# EAGLE design FDC9266_floppy_korr (EAGLE 9.6.2)
Assembly variants: rcbus
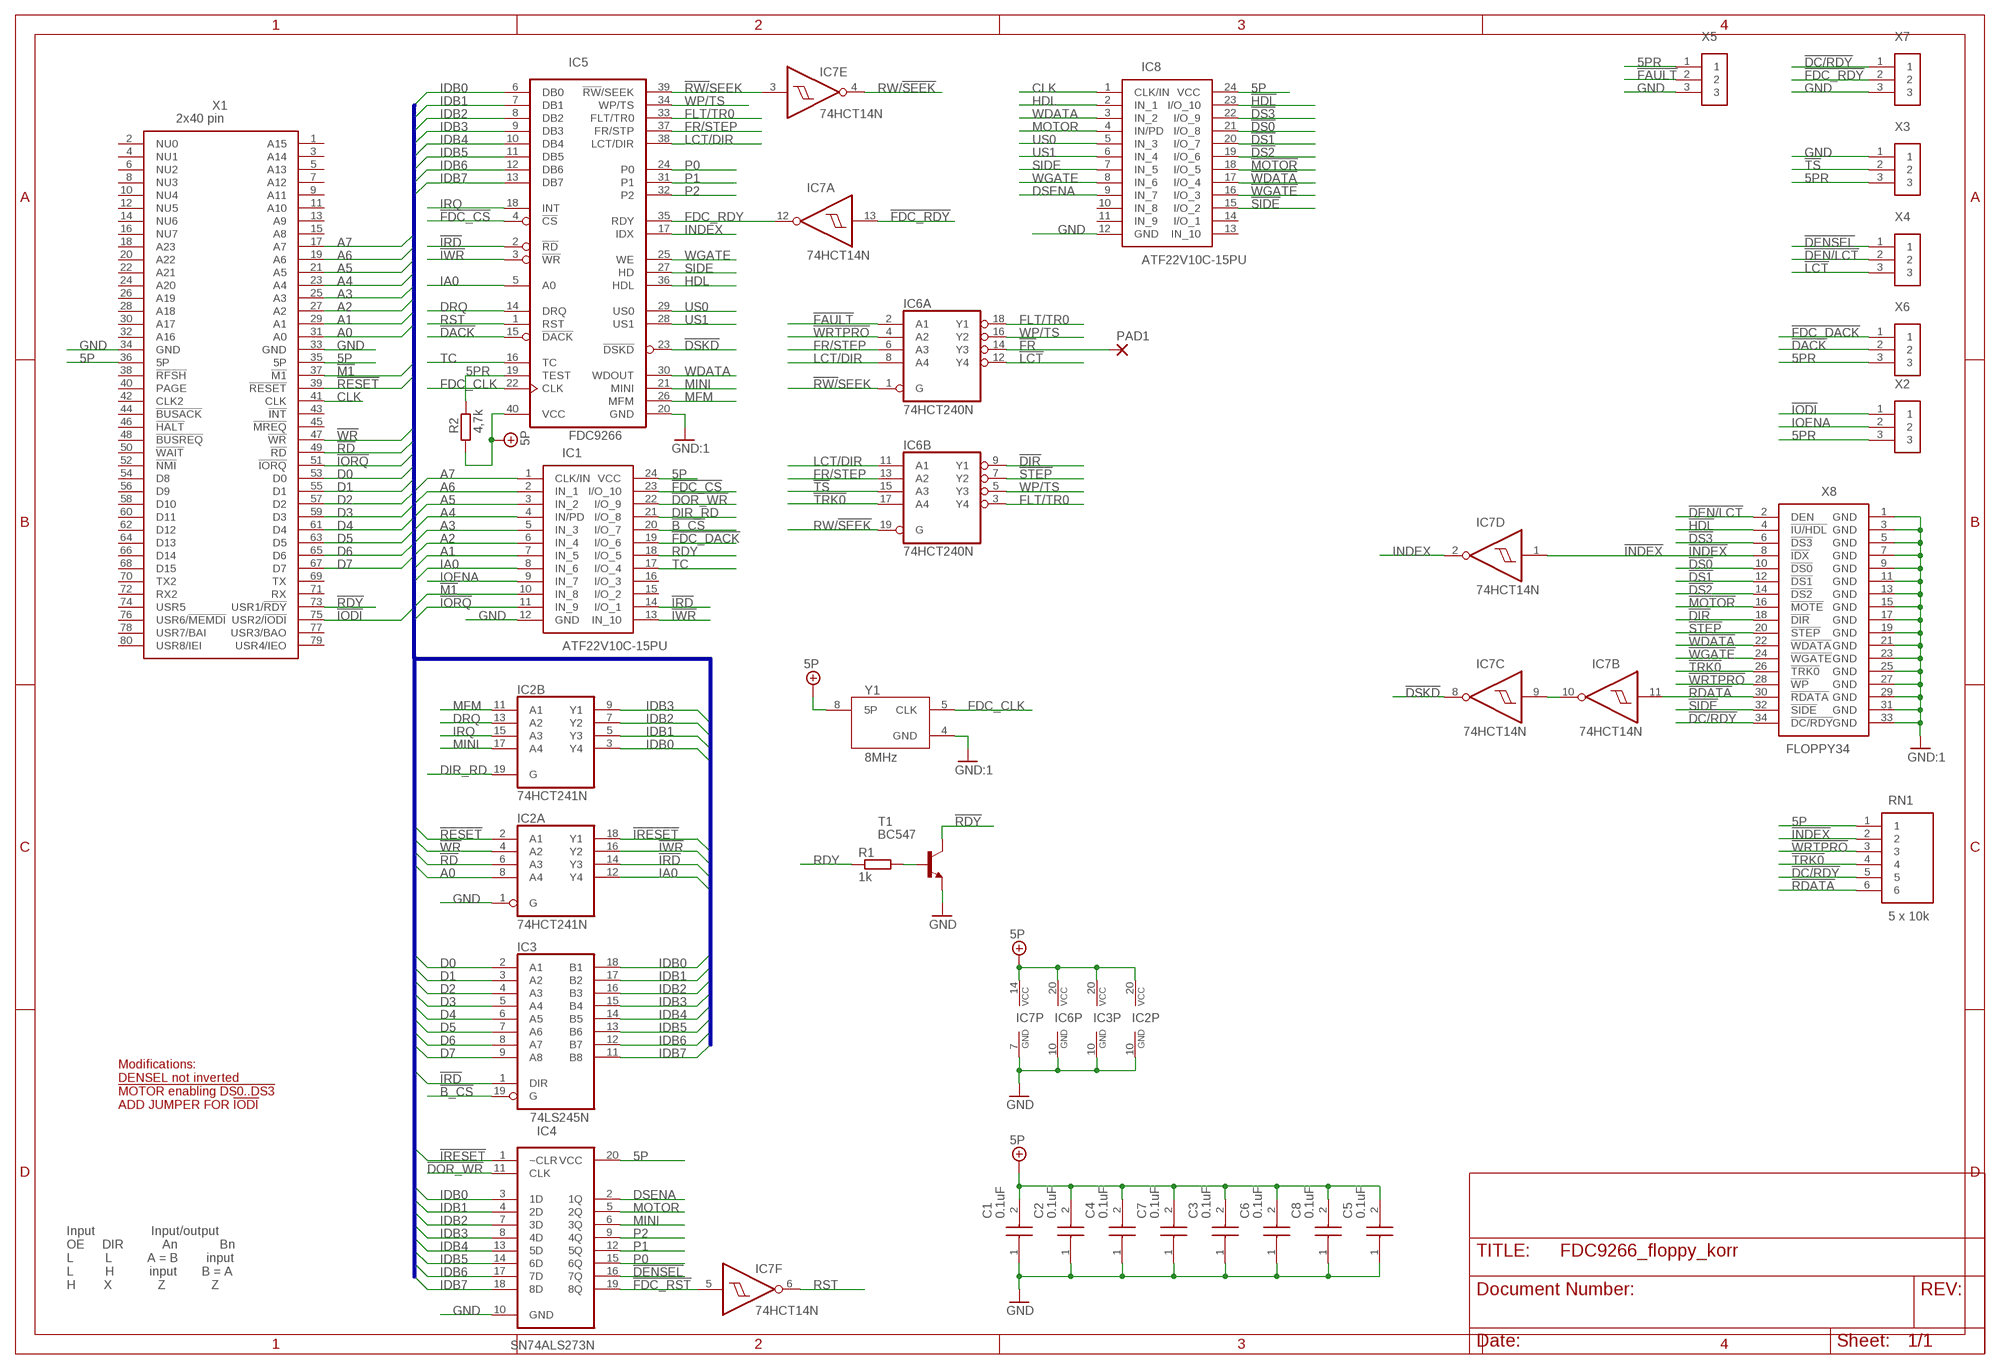
[diagram p0: schematic, sheet 1]

## Parts
C1  0.1uF  C315C103K5R5TA7303  [C315C103K5R5TA7303]
C2  0.1uF  C315C103K5R5TA7303  [C315C103K5R5TA7303]
C3  0.1uF  C315C103K5R5TA7303  [C315C103K5R5TA7303]
C4  0.1uF  C315C103K5R5TA7303  [C315C103K5R5TA7303]
C5  0.1uF  C315C103K5R5TA7303  [C315C103K5R5TA7303]
C6  0.1uF  C315C103K5R5TA7303  [C315C103K5R5TA7303]
C7  0.1uF  C315C103K5R5TA7303  [C315C103K5R5TA7303]
C8  0.1uF  C315C103K5R5TA7303  [C315C103K5R5TA7303]
IC1  ATF22V10C-15PU  [DIP794W56P254L3188H533Q24N]
IC2  74HCT241N  [DIL20]
IC3  74LS245N  [DIL20]
IC4  SN74ALS273N  [DIP254P762X508-20]
IC5  FDC9266  [DIP1550W53P254L5232H424Q40N]
IC6  74HCT240N  [DIL20]
IC7  74HCT14N  [DIL14]
IC8  ATF22V10C-15PU  [DIP794W56P254L3188H533Q24N]
PAD1  WIREPAD1,6/0,8  [1,6/0,8]
R1  1k  R_EU_020710  [0207/10]  (not fitted in variant rcbus)
R2  4,7k  R_EU_020710  [0207/10]
RN1  5 x 10k  4606X-101-103LF  [4606X102103LF]
T1  BC547  [TO92]  (not fitted in variant rcbus)
X1  2x40 pin  RCBUS_80_RA  [RC2014_80_RA]
X2  TSW-103-07-G-S07  [TSW-103-XX-G-S]
X3  TSW-103-07-G-S07  [TSW-103-XX-G-S]
X4  TSW-103-07-G-S07  [TSW-103-XX-G-S]
X5  TSW-103-07-G-S07  [TSW-103-XX-G-S]
X6  TSW-103-07-G-S07  [TSW-103-XX-G-S]
X7  TSW-103-07-G-S07  [TSW-103-XX-G-S]
X8  FLOPPY34  [09185346323]
Y1  8MHz  ECS-2100AX-200  [ECS-2100AX-200]

## Nets
5P: C1.2 C2.2 C3.2 C4.2 C5.2 C6.2 C7.2 C8.2 IC1.24(VCC) IC2.20(P:VCC) IC3.20(VCC) IC4.20(VCC) IC5.40(VCC) IC6.20(P:VCC) IC7.14(P:VCC) IC8.24(VCC) R2.1 RN1.1 X1.35(5P) X1.36(5P) Y1.8(5P)
5PR: IC5.19(TEST) R2.2 X2.3 X3.3 X5.1 X6.3
!B_CS: IC1.20(I/O_7) IC3.19(G)
!DACK: IC5.15(!DACK) X6.2
!DC/RDY: RN1.5 X7.1 X8.34(!DC/RDY)
!DEN/LCT: X4.2 X8.2(DEN)
!DENSEL: IC4.16(7Q) X4.1
!DIR: IC6.9(B:Y1) X8.18(!DIR)
!DOR_WR: IC1.22(I/O_9) IC4.11(CLK)
!DS0: IC8.21(I/O_8) X8.10(!DS0)
!DS1: IC8.20(I/O_7) X8.12(!DS1)
!DS2: IC8.19(I/O_6) X8.14(!DS2)
!DS3: IC8.22(I/O_9) X8.6(!DS3)
!DSKD: IC5.23(!DSKD) IC7.8(C:O)
!FAULT: IC6.2(A:A1) X5.2
!FDC_CS: IC1.23(I/O_10) IC5.4(!CS)
!FDC_DACK: IC1.19(I/O_6) X6.1
!FDC_RDY: IC7.13(A:I) X7.2
!FDC_RST: IC4.19(8Q) IC7.5(F:I)
!FR: IC6.14(A:Y3) PAD1.1(P)
!HDL: IC8.23(I/O_10) X8.4(!IU/HDL)
!INDEX: IC7.1(D:I) RN1.2 X8.8(!IDX)
!IODI: X1.75(USR2/!IODI) X2.1
!IORQ: IC1.11(IN_9) X1.51(!IORQ)
!IRD: IC1.14(I/O_1) IC2.14(A:Y3) IC3.1(DIR) IC5.2(!RD)
!IRESET: IC2.18(A:Y1) IC4.1(~CLR)
!IWR: IC1.13(IN_10) IC2.16(A:Y2) IC5.3(!WR)
!LCT: IC6.12(A:Y4) X4.3
!M1: IC1.10(IN_8) X1.37(!M1)
!MOTOR: IC8.18(I/O_5) X8.16(!MOTE)
!RD: IC2.6(A:A3) X1.49(!RD)
!RDATA: IC7.11(B:I) RN1.6 X8.30(!RDATA)
!RDY: T1.3(C) X1.73(USR1/!RDY)
!RESET: IC2.2(A:A1) X1.39(!RESET)
!RW/!SEEK: IC5.39(!RW!/SEEK) IC6.1(A:G) IC7.3(E:I)
!SIDE: IC8.15(I/O_2) X8.32(!SIDE)
!STEP: IC6.7(B:Y2) X8.20(!STEP)
!TRK0: IC6.17(B:A4) RN1.4 X8.26(!TRK0)
!TS: IC6.15(B:A3) X3.2
!WDATA: IC8.17(I/O_4) X8.22(!WDATA)
!WGATE: IC8.16(I/O_3) X8.24(!WGATE)
!WR: IC2.4(A:A2) X1.47(!WR)
!WRTPRO: IC6.4(A:A2) RN1.3 X8.28(!WP)
A0: IC2.8(A:A4) X1.31(A0)
A1: IC1.7(IN_5) X1.29(A1)
A2: IC1.6(IN_4) X1.27(A2)
A3: IC1.5(IN_3) X1.25(A3)
A4: IC1.4(IN/PD) X1.23(A4)
A5: IC1.3(IN_2) X1.21(A5)
A6: IC1.2(IN_1) X1.19(A6)
A7: IC1.1(CLK/IN) X1.17(A7)
CLK: IC8.1(CLK/IN) X1.41(CLK)
D0: IC3.2(A1) X1.53(D0)
D1: IC3.3(A2) X1.55(D1)
D2: IC3.4(A3) X1.57(D2)
D3: IC3.5(A4) X1.59(D3)
D4: IC3.6(A5) X1.61(D4)
D5: IC3.7(A6) X1.63(D5)
D6: IC3.8(A7) X1.65(D6)
D7: IC3.9(A8) X1.67(D7)
DIR_RD: IC1.21(I/O_8) IC2.19(B:G)
DRQ: IC2.13(B:A2) IC5.14(DRQ)
DSENA: IC4.2(1Q) IC8.9(IN_7)
FDC_CLK: IC5.22(CLK) Y1.5(CLK)
FDC_RDY: IC5.35(RDY) IC7.12(A:O)
FLT/TR0: IC5.33(FLT/TR0) IC6.3(B:Y4) IC6.18(A:Y1)
FR/STEP: IC5.37(FR/STP) IC6.6(A:A3) IC6.13(B:A2)
GND: C1.1 C2.1 C3.1 C4.1 C5.1 C6.1 C7.1 C8.1 IC1.12(GND) IC2.1(A:G) IC2.10(P:GND) IC3.10(GND) IC4.10(GND) IC5.20(GND) IC6.10(P:GND) IC7.7(P:GND) IC8.12(GND) T1.1(E) X1.33(GND) X1.34(GND) X3.1 X5.3 X7.3 X8.1(GND) X8.3(GND) X8.5(GND) X8.7(GND) X8.9(GND) X8.11(GND) X8.13(GND) X8.15(GND) X8.17(GND) X8.19(GND) X8.21(GND) X8.23(GND) X8.25(GND) X8.27(GND) X8.29(GND) X8.31(GND) X8.33(GND) Y1.4(GND) ; supply symbol labelled GND:1
HDL: IC5.36(HDL) IC8.2(IN_1)
IA0: IC1.8(IN_6) IC2.12(A:Y4) IC5.5(A0)
IDB0: IC2.3(B:Y4) IC3.18(B1) IC4.3(1D) IC5.6(DB0)
IDB1: IC2.5(B:Y3) IC3.17(B2) IC4.4(2D) IC5.7(DB1)
IDB2: IC2.7(B:Y2) IC3.16(B3) IC4.7(3D) IC5.8(DB2)
IDB3: IC2.9(B:Y1) IC3.15(B4) IC4.8(4D) IC5.9(DB3)
IDB4: IC3.14(B5) IC4.13(5D) IC5.10(DB4)
IDB5: IC3.13(B6) IC4.14(6D) IC5.11(DB5)
IDB6: IC3.12(B7) IC4.17(7D) IC5.12(DB6)
IDB7: IC3.11(B8) IC4.18(8D) IC5.13(DB7)
INDEX: IC5.17(IDX) IC7.2(D:O)
IOENA: IC1.9(IN_7) X2.2
IRQ: IC2.15(B:A3) IC5.18(INT)
LCT/DIR: IC5.38(LCT/DIR) IC6.8(A:A4) IC6.11(B:A1)
MFM: IC2.11(B:A1) IC5.26(MFM)
MINI: IC2.17(B:A4) IC4.6(3Q) IC5.21(MINI)
MOTOR: IC4.5(2Q) IC8.4(IN/PD)
N$1: IC7.9(C:I) IC7.10(B:O)
N$3: R1.2 T1.2(B)
P0: IC4.15(6Q) IC5.24(P0)
P1: IC4.12(5Q) IC5.31(P1)
P2: IC4.9(4Q) IC5.32(P2)
RDY: IC1.18(I/O_5) R1.1
RST: IC5.1(RST) IC7.6(F:O)
RW/!SEEK: IC6.19(B:G) IC7.4(E:O)
SIDE: IC5.27(HD) IC8.7(IN_5)
TC: IC1.17(I/O_4) IC5.16(TC)
US0: IC5.29(US0) IC8.5(IN_3)
US1: IC5.28(US1) IC8.6(IN_4)
WDATA: IC5.30(WDOUT) IC8.3(IN_2)
WGATE: IC5.25(WE) IC8.8(IN_6)
WP/TS: IC5.34(WP/TS) IC6.5(B:Y3) IC6.16(A:Y2)
Unconnected: IC1.15(I/O_2) IC1.16(I/O_3) IC8.10(IN_8) IC8.11(IN_9) IC8.13(IN_10) IC8.14(I/O_1) X1.1(A15) X1.2(NU0) X1.3(A14) X1.4(NU1) X1.5(A13) X1.6(NU2) X1.7(A12) X1.8(NU3) X1.9(A11) X1.10(NU4) X1.11(A10) X1.12(NU5) X1.13(A9) X1.14(NU6) X1.15(A8) X1.16(NU7) X1.18(A23) X1.20(A22) X1.22(A21) X1.24(A20) X1.26(A19) X1.28(A18) X1.30(A17) X1.32(A16) X1.38(!RFSH) X1.40(PAGE) X1.42(CLK2) X1.43(!INT) X1.44(!BUSACK) X1.45(!MREQ) X1.46(!HALT) X1.48(!BUSREQ) X1.50(!WAIT) X1.52(!NMI) X1.54(D8) X1.56(D9) X1.58(D10) X1.60(D11) X1.62(D12) X1.64(D13) X1.66(D14) X1.68(D15) X1.69(TX) X1.70(TX2) X1.71(RX) X1.72(RX2) X1.74(USR5) X1.76(USR6/!MEMDI) X1.77(USR3/BAO) X1.78(USR7/BAI) X1.79(USR4/IEO) X1.80(USR8/IEI)

## Buses
A[0..7],CLK,D[0..7],IA0,IDB[0..7],!IODI,!IORQ,!IRD,!IRESET,!IWR,!M1,!RD,!RESET,!WR

## Notes on the sheet
- Modifications:
  DENSEL not inverted
  !MOTOR enabling DS0..DS3
  ADD JUMPER FOR !IODI
- Input                Input/output
  OE     DIR           An            Bn
  L         L          A = B        input
  L         H          input       B = A
  H        X             Z             Z

## Library data of the parts
C1-C8 = FDC9266_floppy_korr:C315C103K5R5TA7303: GoldMax 300 Comm X7R, Ceramic, 0.01 uF, 10%, 50 VDC, 125 VDC, 125C, -55C, X7R, GoldMax, Commercial Standard, 2.5 % , 100 GOhms, 3.81mm, 3.14mm, 2.54mm, Lead Spacing = 2.54mm, 18mm, 0.51mm, 2500, 80 Source: Datasheet <https://content.kemet.com/datasheets/KEM_C1050_GOLDMAX_X7R.pdf>; ARROW_PART_NUMBER: C315C103K5R5TA7303; ARROW_PRICE-STOCK: https://www.arrow.com/en/products/c315c103k5r5ta7303/kemet-corporation?region=nac; DESCRIPTION: GoldMax 300 Comm X7R, Ceramic, 0.01 uF, 10%, 50 VDC, 125 VDC, 125C, -55C, X7R, GoldMax, Commercial Standard, 2.5 % , 100 GOhms, 3.81mm, 3.14mm, 2.54mm, Lead Spacing = 2.54mm, 18mm, 0.51mm, 2500, 80; HEIGHT: 4.66mm; MANUFACTURER_NAME: KEMET; MANUFACTURER_PART_NUMBER: C315C103K5R5TA7303; MOUSER_PART_NUMBER: 80-C315C103K5R-TR; MOUSER_PRICE-STOCK: https://www.mouser.co.uk/ProductDetail/KEMET/C315C103K5R5TA7303?qs=LJ1pyEEo5rYBfSJP9%252BZ%252BkA%3D%3D
IC1 IC8 = FDC9266_floppy_korr:ATF22V10C-15PU: Microchip ATF22V10C-15PU, SPLD Simple Programmable Logic Device Source: Datasheet <http://ww1.microchip.com/downloads/en/DeviceDoc/doc0735.pdf>; ARROW_PART_NUMBER: ATF22V10C-15PU; ARROW_PRICE-STOCK: https://www.arrow.com/en/products/atf22v10c-15pu/microchip-technology?region=nac; DESCRIPTION: Microchip ATF22V10C-15PU, SPLD Simple Programmable Logic Device; HEIGHT: 5.334mm; MANUFACTURER_NAME: Microchip; MANUFACTURER_PART_NUMBER: ATF22V10C-15PU; MOUSER_PART_NUMBER: 556-AF22V10C15PU; MOUSER_PRICE-STOCK: https://www.mouser.co.uk/ProductDetail/Microchip-Technology-Atmel/ATF22V10C-15PU?qs=2mdvTlUeTfCr46ZvfjTtAg%3D%3D
IC2 = FDC9266_floppy_korr:74*241: Octal BUFFER and LINE DRIVER, 3-state
IC3 = FDC9266_floppy_korr:74*245: Octal BUS TRANSCEIVER, 3-state
IC4 = FDC9266_floppy_korr:SN74ALS273N: OCTAL D-TYPE FLIP-FLOPS; MPN: SN74ALS273N; OC_FARNELL: 1607723; OC_NEWARK: 08F6025; PACKAGE: PDIP-20; SUPPLIER: Texas Instruments
IC5 = FDC9266_floppy_korr:FDC9266: FDC9266 MFM Disk Controller
IC6 = FDC9266_floppy_korr:74*240: Octal BUFFER and LINE DRIVER, 3-state
IC7 = FDC9266_floppy_korr:74*14: Hex schmitt trigger INVERTER
PAD1 = FDC9266_floppy_korr:WIREPAD: Wire PAD connect wire on PCB
R1 R2 = FDC9266_floppy_korr:R_EU_0207: RESISTOR, European symbol; SPICEPREFIX: R
RN1 = FDC9266_floppy_korr:4606X-101-103LF: 5-bussed thick film resistor,10K 0.2W Bourns Bussed Resistor Network 10k +/-2% 5 Resistors, 0.75W Total, SIP package 4600X Through Hole Source: Datasheet <https://www.bourns.com/pdfs/4600X.pdf>; ARROW_PART_NUMBER: 4606X-101-103LF; ARROW_PRICE-STOCK: https://www.arrow.com/en/products/4606x-101-103lf/bourns?region=europe; DESCRIPTION: 5-bussed thick film resistor,10K 0.2W Bourns Bussed Resistor Network 10k +/-2% 5 Resistors, 0.75W Total, SIP package 4600X Through Hole; HEIGHT: 5mm; MANUFACTURER_NAME: Bourns; MANUFACTURER_PART_NUMBER: 4606X-101-103LF; MOUSER_PART_NUMBER: 652-4606X-1LF-10K; MOUSER_PRICE-STOCK: https://www.mouser.co.uk/ProductDetail/Bourns/4606X-101-103LF?qs=Qv7qbSW4mEHqAfbN3SBBUw%3D%3D
T1 = FDC9266_floppy_korr:BC547: NPN TRANSISTOR
X1 = FDC9266_floppy_korr:RCBUS_80_RA: RC2014 extended bus 80 pin board connector
X2-X7 = FDC9266_floppy_korr:TSW-103-07-G-S: THROUGH-HOLE .025" SQ POST HEADER Source: Samtec TSW.pdf; MF: Samtec Inc.; MPN: TSW-103-07-G-S
X8 = FDC9266_floppy_korr:FLOPPY34: Connectors, Male connector, Wave soldering termination, Rated current: 1 A, Angled, Copper alloy, Sn over Ni, Termination side, Au over Pd/Ni, Mating side, Performance level: 2, Thermoplastic resin (PBT), Grey Source: Datasheet <https://b2b.harting.com/files/download/PRD/PDF_TS/09185XXX323_100154466DRW007A.pdf?showPrivacyEmailAgreement=false&contextURL=https://b2b.harting.com/ebusiness/en_us&siteName=Ebusiness Site&autoLogoutEnabled=true&autoLogoutTime=1805>; ARROW_PART_NUMBER: 09185346323; ARROW_PRICE-STOCK: https://www.arrow.com/en/products/09185346323/harting?region=nac; DESCRIPTION: Connectors, Male connector, Wave soldering termination, Rated current: 1 A, Angled, Copper alloy, Sn over Ni, Termination side, Au over Pd/Ni, Mating side, Performance level: 2, Thermoplastic resin (PBT), Grey; HEIGHT: 8.9mm; MANUFACTURER_NAME: HARTING; MANUFACTURER_PART_NUMBER: 09185346323; MOUSER_PART_NUMBER: 617-09-18-534-6323; MOUSER_PRICE-STOCK: https://www.mouser.co.uk/ProductDetail/HARTING/09185346323?qs=GZB%2FOSW0r0GMbz7Zhp6Wbw%3D%3D
Y1 = FDC9266_floppy_korr:ECS-2100AX-200: XTAL OSC XO 20.0000MHZ HCMOS TTL Manufacturer's datasheet <https://ecsxtal.com/store/pdf/ecs-2100x.pdf>; CREATED_BY: PCBLayout.com; DIGIKEY_PART_NUMBER: X964-ND; MANUFACTURER: ECS Inc.; MPN: ECS-2100AX-200; PACKAGE: 8-DIP

## Net classes
0 default: width 0.254 mm
1 pwr: width 1.016 mm

## Board
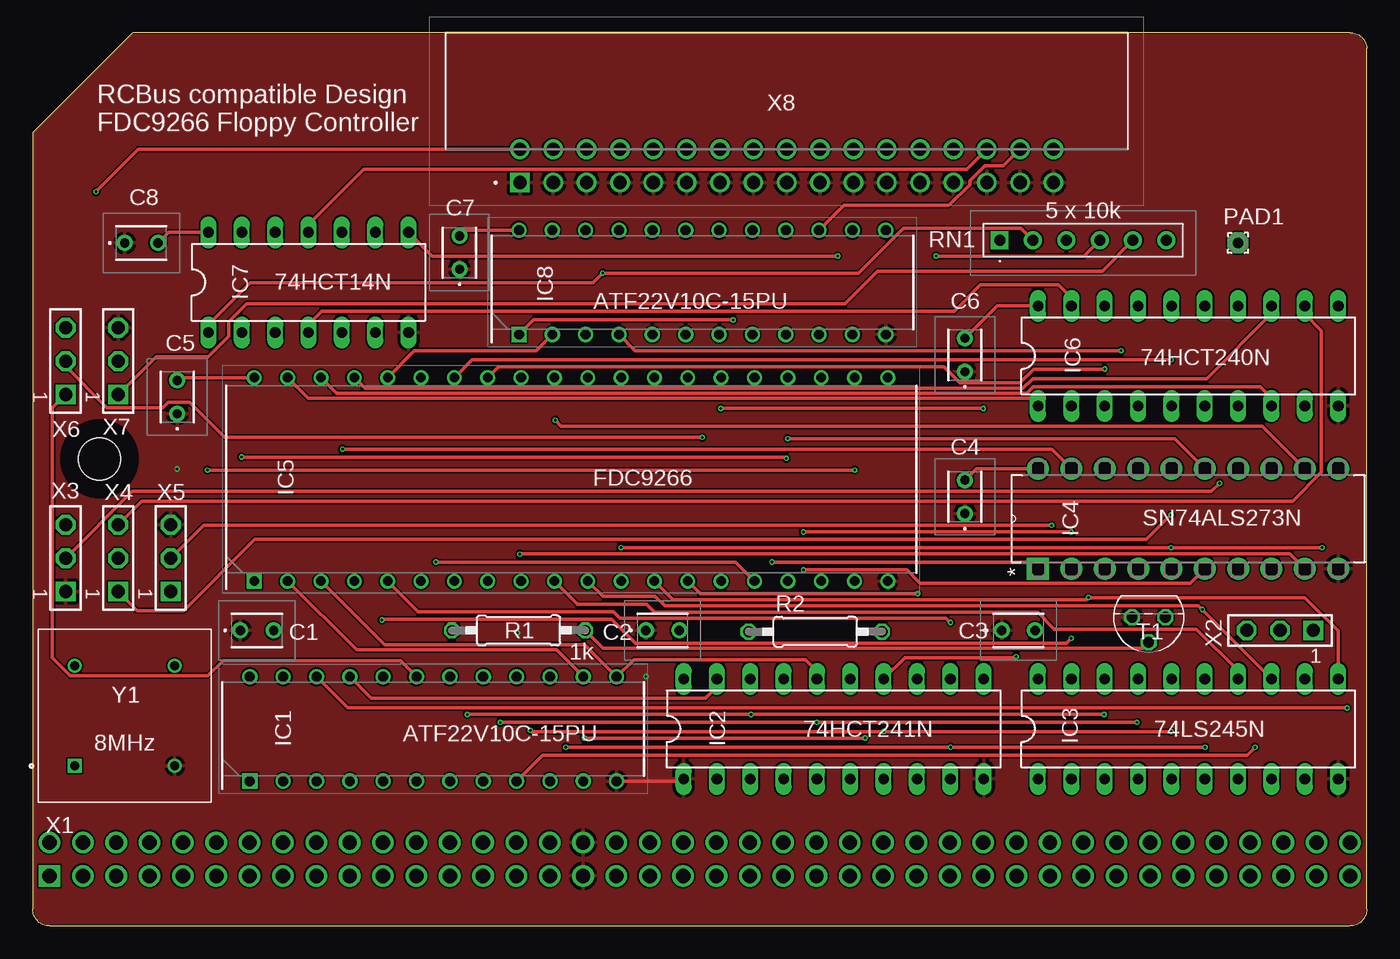
[diagram p1: board, top side]
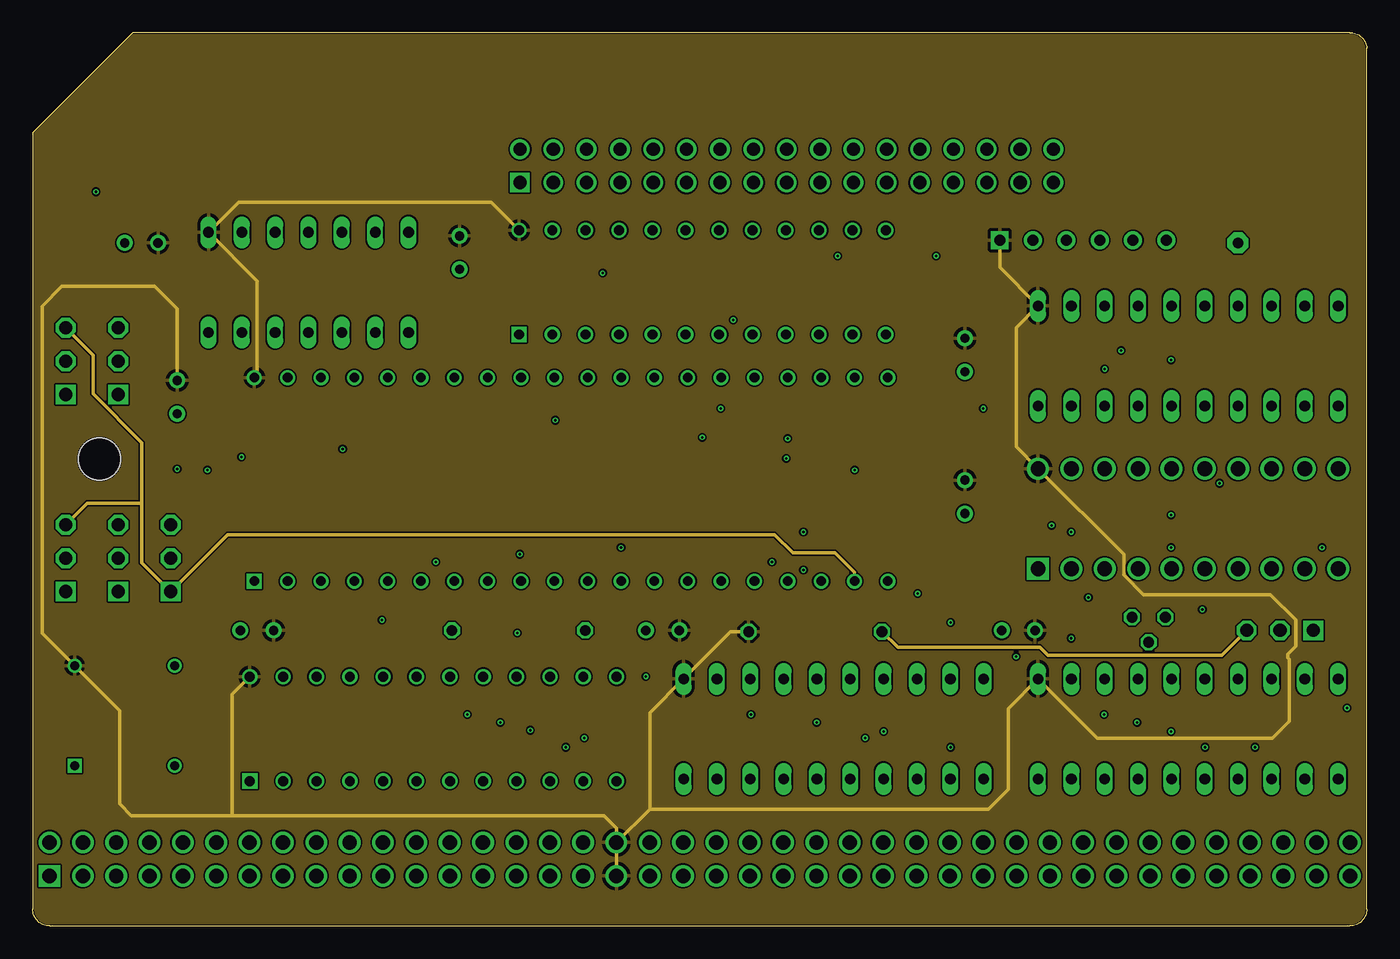
[diagram p2: board, inner layer Route2]
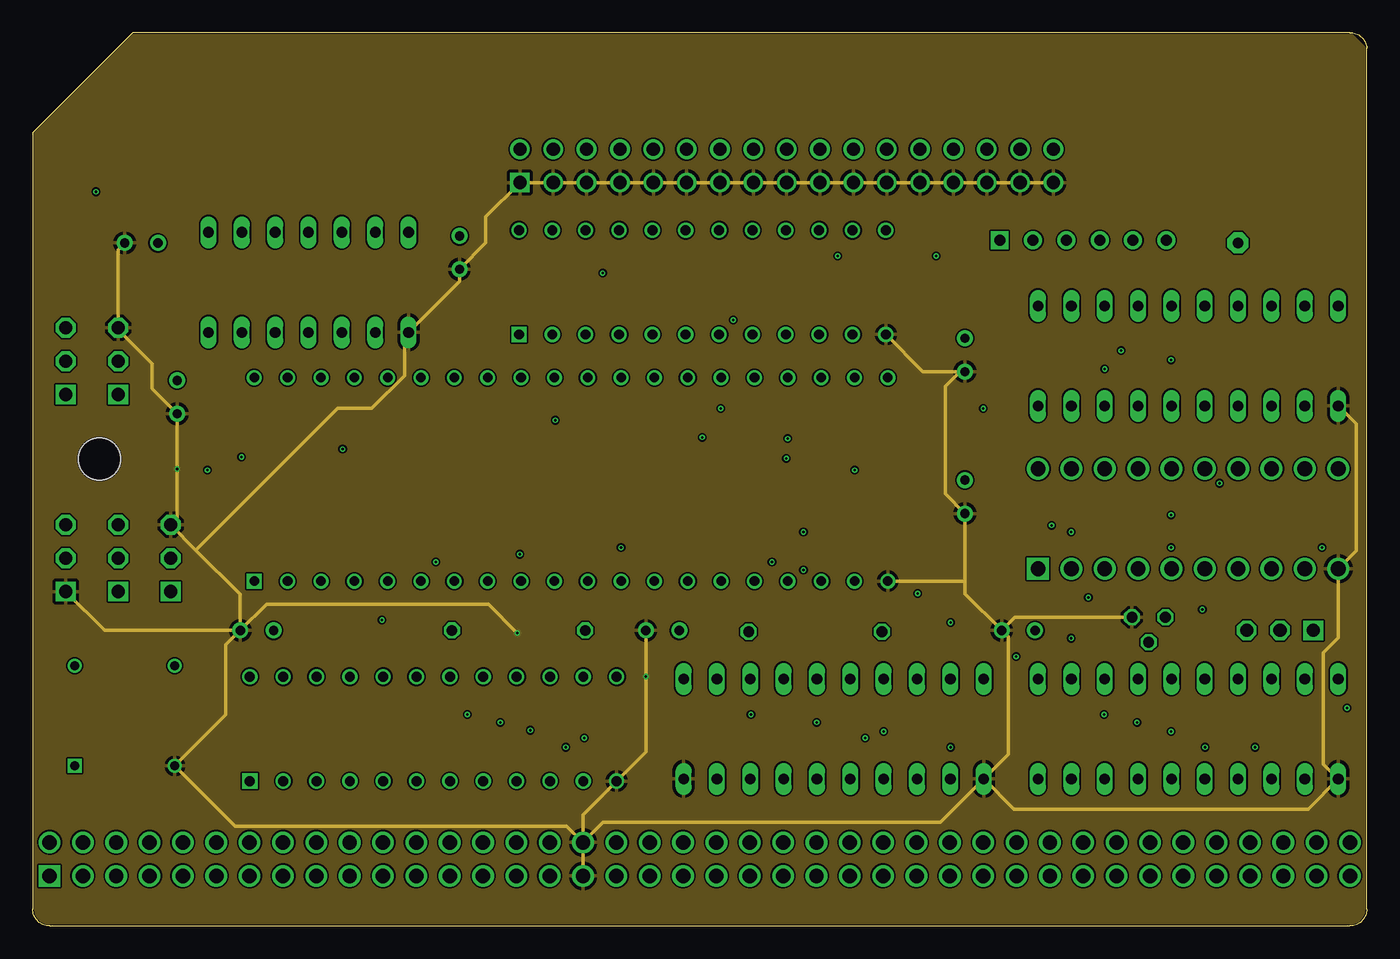
[diagram p3: board, inner layer Route15]
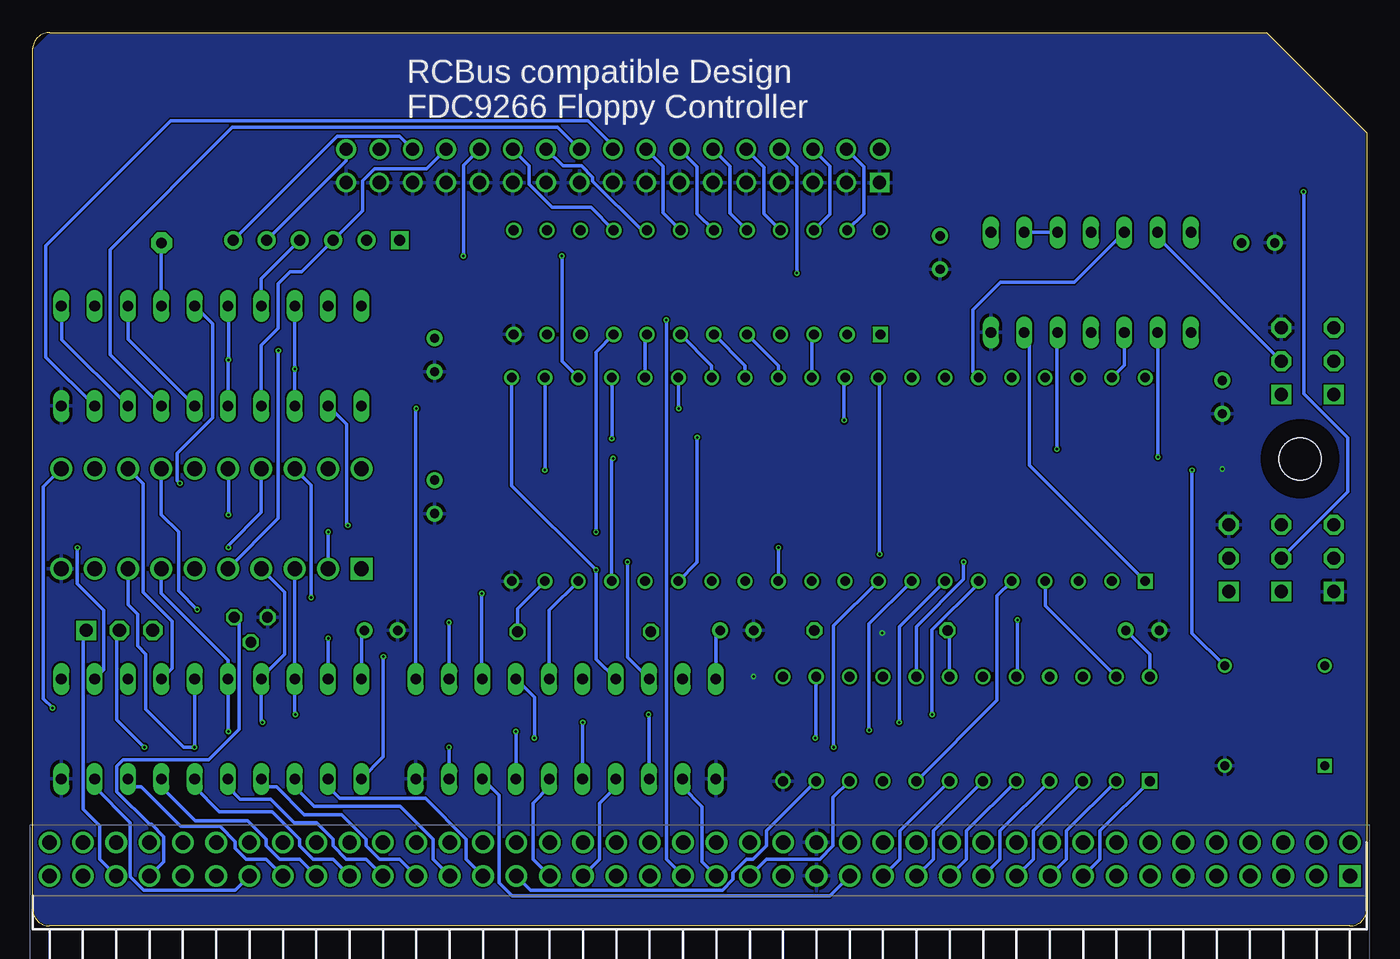
[diagram p4: board, bottom side, seen from below]

Size 101.6 x 68 mm. Coordinates in mm from the lower left corner, seen from the top.
Outline: 1.27,0 100.33,0 arc90 101.6,1.27 101.6,66.83 arc90 100.33,68 7.62,68 0,60.38 0,1.27 arc90 1.27,0
Copper layers (1*2*15*16): Top 0.035mm / dielectric 0.2mm / Route2 0.0175mm / dielectric 1.065mm / Route15 0.0175mm / dielectric 0.2mm / Bottom 0.035mm
Design rules "jlcpcb-4-layer_laci": minimum track width 5mil, minimum drill 0.2mm, track to track 0.126490625mm, track to pad 0.126490625mm, pad to pad 0.126490625mm, via to via 0.126490625mm, smd to smd 0mil, copper to edge 0.1mm, drill to drill 5mil, minimum pad ring 4mil, minimum via ring 4mil, stop-mask expansion 3mil, vias tented up to drill 100mil, thermal gap 10mil
Holes 3.2 mm at 5.08,35.56
tRestrict: area 2.1,32.6 to 8.1,38.6
bRestrict: area 2.1,32.6 to 8.1,38.6

### Footprints (pad centres in the part's own frame; a part is rotated, then mirrored left to right if it is on the bottom)
C315C103K5R5TA7303 = drill 0.71 pad 1.217: 1 0,0; 2 2.54,0
DIP794W56P254L3188H533Q24N = drill 0.759 pad 1.159 square: 1 -3.969,13.97 | drill 0.759 pad 1.159: 2 -3.969,11.43; 3 -3.969,8.89; 4 -3.969,6.35; 5 -3.969,3.81; 6 -3.969,1.27; 7 -3.969,-1.27; 8 -3.969,-3.81; 9 -3.969,-6.35; 10 -3.969,-8.89; 11 -3.969,-11.43; 12 -3.969,-13.97; 13 3.969,-13.97; 14 3.969,-11.43; 15 3.969,-8.89; 16 3.969,-6.35; 17 3.969,-3.81; 18 3.969,-1.27; 19 3.969,1.27; 20 3.969,3.81; 21 3.969,6.35; 22 3.969,8.89; 23 3.969,11.43; 24 3.969,13.97
DIL20 = drill 0.813 long: 1 -11.43,-3.81; 2 -8.89,-3.81; 3 -6.35,-3.81; 4 -3.81,-3.81; 5 -1.27,-3.81; 6 1.27,-3.81; 7 3.81,-3.81; 8 6.35,-3.81; 9 8.89,-3.81; 10 11.43,-3.81; 11 11.43,3.81; 12 8.89,3.81; 13 6.35,3.81; 14 3.81,3.81; 15 1.27,3.81; 16 -1.27,3.81; 17 -3.81,3.81; 18 -6.35,3.81; 19 -8.89,3.81; 20 -11.43,3.81
DIP254P762X508-20 = drill 1.118 square: 1 -3.81,11.43 | drill 1.118: 2 -3.81,8.89; 3 -3.81,6.35; 4 -3.81,3.81; 5 -3.81,1.27; 6 -3.81,-1.27; 7 -3.81,-3.81; 8 -3.81,-6.35; 9 -3.81,-8.89; 10 -3.81,-11.43; 11 3.81,-11.43; 12 3.81,-8.89; 13 3.81,-6.35; 14 3.81,-3.81; 15 3.81,-1.27; 16 3.81,1.27; 17 3.81,3.81; 18 3.81,6.35; 19 3.81,8.89; 20 3.81,11.43
DIP1550W53P254L5232H424Q40N = drill 0.73 pad 1.13 square: 1 -7.748,24.13 | drill 0.73 pad 1.13: 2 -7.748,21.59; 3 -7.748,19.05; 4 -7.748,16.51; 5 -7.748,13.97; 6 -7.748,11.43; 7 -7.748,8.89; 8 -7.748,6.35; 9 -7.748,3.81; 10 -7.748,1.27; 11 -7.748,-1.27; 12 -7.748,-3.81; 13 -7.748,-6.35; 14 -7.748,-8.89; 15 -7.748,-11.43; 16 -7.748,-13.97; 17 -7.748,-16.51; 18 -7.748,-19.05; 19 -7.748,-21.59; 20 -7.748,-24.13; 21 7.748,-24.13; 22 7.748,-21.59; 23 7.748,-19.05; 24 7.748,-16.51; 25 7.748,-13.97; 26 7.748,-11.43; 27 7.748,-8.89; 28 7.748,-6.35; 29 7.748,-3.81; 30 7.748,-1.27; 31 7.748,1.27; 32 7.748,3.81; 33 7.748,6.35; 34 7.748,8.89; 35 7.748,11.43; 36 7.748,13.97; 37 7.748,16.51; 38 7.748,19.05; 39 7.748,21.59; 40 7.748,24.13
DIL14 = drill 0.813 long: 1 -7.62,-3.81; 2 -5.08,-3.81; 3 -2.54,-3.81; 4 0,-3.81; 5 2.54,-3.81; 6 5.08,-3.81; 7 7.62,-3.81; 8 7.62,3.81; 9 5.08,3.81; 10 2.54,3.81; 11 0,3.81; 12 -2.54,3.81; 13 -5.08,3.81; 14 -7.62,3.81
1,6/0,8 = drill 0.813 pad 1.6 octagon: 1 0,0
0207/10 = drill 0.813 octagon: 1 -5.08,0; 2 5.08,0
4606X102103LF = drill 0.84 pad 1.365 square: 1 -6.355,0.203 | drill 0.84 pad 1.365: 2 -3.815,0.203; 3 -1.275,0.203; 4 1.265,0.203; 5 3.805,0.203; 6 6.345,0.203
TO92 = drill 0.813 octagon: 1 1.27,0; 2 0,1.905; 3 -1.27,0
RC2014_80_RA = drill 1.1 pad 1.65 square: 1 0,0 | drill 1.1 pad 1.65: 2 0,2.54; 3 2.54,0; 4 2.54,2.54; 5 5.08,0; 6 5.08,2.54; 7 7.62,0; 8 7.62,2.54; 9 10.16,0; 10 10.16,2.54; 11 12.7,0; 12 12.7,2.54; 13 15.24,0; 14 15.24,2.54; 15 17.78,0; 16 17.78,2.54; 17 20.32,0; 18 20.32,2.54; 19 22.86,0; 20 22.86,2.54; 21 25.4,0; 22 25.4,2.54; 23 27.94,0; 24 27.94,2.54; 25 30.48,0; 26 30.48,2.54; 27 33.02,0; 28 33.02,2.54; 29 35.56,0; 30 35.56,2.54; 31 38.1,0; 32 38.1,2.54; 33 40.64,0; 34 40.64,2.54; 35 43.18,0; 36 43.18,2.54; 37 45.72,0; 38 45.72,2.54; 39 48.26,0; 40 48.26,2.54; 41 50.8,0; 42 50.8,2.54; 43 53.34,0; 44 53.34,2.54; 45 55.88,0; 46 55.88,2.54; 47 58.42,0; 48 58.42,2.54; 49 60.96,0; 50 60.96,2.54; 51 63.5,0; 52 63.5,2.54; 53 66.04,0; 54 66.04,2.54; 55 68.58,0; 56 68.58,2.54; 57 71.12,0; 58 71.12,2.54; 59 73.66,0; 60 73.66,2.54; 61 76.2,0; 62 76.2,2.54; 63 78.74,0; 64 78.74,2.54; 65 81.28,0; 66 81.28,2.54; 67 83.82,0; 68 83.82,2.54; 69 86.36,0; 70 86.36,2.54; 71 88.9,0; 72 88.9,2.54; 73 91.44,0; 74 91.44,2.54; 75 93.98,0; 76 93.98,2.54; 77 96.52,0; 78 96.52,2.54; 79 99.06,0; 80 99.06,2.54
TSW-103-XX-G-S = drill 1 pad 1.5 square: 1 2.54,0 | drill 1 pad 1.5 octagon: 2 0,0; 3 -2.54,0
09185346323 = drill 1 pad 1.5 square: 1 0,0 | drill 1 pad 1.5: 2 0,2.54; 3 2.54,0; 4 2.54,2.54; 5 5.08,0; 6 5.08,2.54; 7 7.62,0; 8 7.62,2.54; 9 10.16,0; 10 10.16,2.54; 11 12.7,0; 12 12.7,2.54; 13 15.24,0; 14 15.24,2.54; 15 17.78,0; 16 17.78,2.54; 17 20.32,0; 18 20.32,2.54; 19 22.86,0; 20 22.86,2.54; 21 25.4,0; 22 25.4,2.54; 23 27.94,0; 24 27.94,2.54; 25 30.48,0; 26 30.48,2.54; 27 33.02,0; 28 33.02,2.54; 29 35.56,0; 30 35.56,2.54; 31 38.1,0; 32 38.1,2.54; 33 40.64,0; 34 40.64,2.54
ECS-2100AX-200 = drill 0.7 square: 1 -3.81,-3.81 | drill 0.7: 4 3.81,-3.81; 5 3.81,3.81; 8 -3.81,3.81

### Placement (x,y rotation side)
C1  15.8,22.5 0 top
C2  46.7,22.5 0 top
C3  73.8,22.5 0 top
C4  71,31.4 90 top
C5  11,39 90 top
C6  71,42.2 90 top
C7  32.5,50 90 top
C8  7,52 0 top
IC1  30.5,15 90 top
IC2  61,15 0 top
IC3  88,15 0 top
IC4  88,31 90 top
IC5  41,34 90 top
IC6  88,43.4 0 top
IC7  21,49 0 top
IC8  51,49 90 top
PAD1  91.8,52 0 top
R1  37,22.5 0 top
R2  59.6,22.4 0 top
RN1  80,52 0 top
T1  85,23.5 180 top
X1  1.27,3.81 0 top
X2  95,22.5 0 top
X3  2.5,28 270 top
X4  6.5,28 270 top
X5  10.5,28 270 top
X6  2.5,43 270 top
X7  6.5,43 270 top
X8  37.1,56.6 0 top
Y1  7,16 0 top

### Tracks (layer width: path | path; a pad name or v marks a point on that pad's centre or on a via)
5P
  Top 0.254: IC4.20 71.87,34.81 C4.2 | IC6.20 73.47,47.21 C6.2 | IC8.24 32.93,52.97 C7.2 | IC7.14 10.35,52.81 C8.2 | IC5.40 11.21,41.75 C5.2
  Route2 0.254: X1.35 X1.36 | 15.2,8.4 7.5,8.4 6.6,9.3 6.6,16.4 Y1.8 0.7,22.3 0.7,47.2 2.2,48.7 9.3,48.7 11,47 C5.2 | 15.2,8.4 43.5,8.4 44.45,7.45 X1.36 | IC1.24 15.2,17.64 15.2,8.4 | X1.36 47,8.9 | 47,8.9 47,16.24 IC2.20 53.16,22.4 R2.1 | 47,8.9 72.8,8.9 74.3,10.4 74.3,16.54 IC3.20 81.08,14.3 94.4,14.3 95.7,15.6 95.7,20.3 95.6,20.4 95.6,20.7 96.2,21.3 96.2,23.3 94.27,25.23 84.61,25.23 83.1,26.74 83.1,28.28 IC4.20 74.9,36.48 74.9,45.54 IC6.20 73.64,50.13 RN1.1 | IC8.24 34.9,55.1 15.67,55.1 IC7.14 17.1,49.09 17.1,41.98 IC5.40
  Bottom 0.254: IC1.24 16.53,20.69 C1.2 | IC2.20 49.57,22.17 C2.2 | IC3.20 76.57,22.27 C3.2
  pour Route2: -0.2,-0.3 -0.2,60.6 7.3,68.1 101.7,68.1 101.7,-0.5 0,-0.5
5PR
  Route2 0.254: X3.3 4.16,32.2 6,32.2 7.1,32.2 8.3,32.2 | R2.2 65.88,21.2 76.7,21.2 77.3,20.6 90.56,20.6 X2.3 | IC5.19 62.59,26.91 61.1,28.4 57.9,28.4 56.5,29.8 14.84,29.8 X5.1 8.3,27.66 8.3,31 8.3,32.2 | X6.3 4.6,43.44 4.6,40.5 8.3,36.8 8.3,32.2
  Bottom 0.254: R2.2 64.68,24.16 IC5.19
!B_CS  (via drill 0.2)
  Top 0.254: v79.1,21.9 78.74,21.54 45.91,21.54 44.09,23.36 26.66,23.36 v26.6,23.3
  Bottom 0.254: IC3.19 v79.11,21.89 v79.1,21.9 | v26.6,23.3 26.6,19.06 IC1.20
!DACK  (via drill 0.2)
  Top 0.254: X6.2 2.5,42.6 5.64,39.46 9.91,39.46 10.31,39.86 11.94,39.86 14.6,37.2 v51,37.2
  Bottom 0.254: v51,37.2 51,27.68 IC5.15
!DC/RDY
  Top 0.254: RN1.5 81.45,49.85 64.34,49.85 61.88,47.39 16.29,47.39 14.91,46.01 14.91,44.88 13.36,43.34 9.38,43.34 X7.1
  Bottom 0.254: X8.34 77.74,58.27 RN1.5
!DEN/LCT  (via drill 0.2)
  Top 0.254: X8.2 8.04,59.14 v4.8,55.9
  Bottom 0.254: v4.8,55.9 4.8,40.5 1.45,37.16 1.45,33.05 X4.2
!DENSEL  (via drill 0.2)
  Top 0.254: v86.7,31.3 84.82,29.42 16.9,29.42 11.48,24 7.96,24 X4.1
  Bottom 0.254: v86.7,31.3 86.7,34.78 IC4.16
!DIR
  Bottom 0.254: IC6.9 100.6,43.3 100.6,51.8 91.1,61.3 59.3,61.3 57.42,59.42 X8.18
!DOR_WR  (via drill 0.2)
  Top 0.254: v100.1,16.6 23.98,16.6 IC1.22
  Bottom 0.254: v100.1,16.6 100.8,17.3 100.8,33.44 IC4.11
!DS0
  Bottom 0.254: IC8.21 45.9,54.22 45.9,57.78 X8.10
!DS1
  Bottom 0.254: IC8.20 48.5,54.28 48.5,57.84 X8.12
!DS2
  Bottom 0.254: IC8.19 51,54.24 51,57.8 X8.14
!DS3
  Bottom 0.254: IC8.22 40.9,54.18 40.9,57.86 X8.6
!DSKD  (via drill 0.2)
  Top 0.254: v61.3,51 30.43,51 IC7.8
  Bottom 0.254: IC5.23 61.3,43 v61.3,51
!FAULT  (via drill 0.2)
  Top 0.254: X5.2 13,30.5 v77.6,30.5
  Bottom 0.254: v77.6,30.5 77.7,30.6 77.7,38.18 IC6.2
!FDC_CS
  Bottom 0.254: IC1.23 24.49,24.39 IC5.4
!FDC_DACK
  Top 0.254: IC1.19 28,20.2 14.5,20.2 13.33,19.03 2.87,19.03 1.5,20.4 1.5,39.46 X6.1
!FDC_RDY
  Bottom 0.254: X7.2 15.92,52.42 IC7.13
!FDC_RST  (via drill 0.2)
  Top 0.254: IC4.19 77.62,36.3 v23.6,36.3
  Bottom 0.254: v23.6,36.3 23.6,45.13 IC7.5
!FR
  Bottom 0.254: IC6.14 PAD1.1
!HDL
  Bottom 0.254: IC8.23 38.3,54.24 38.3,57.8 X8.4
!INDEX  (via drill 0.2)
  Top 0.254: RN1.2 75.25,53.14 66.32,53.14 62.88,49.7 v43.4,49.7 42.67,48.97 | 42.67,48.97 16.55,48.97 | 16.55,48.97 13.38,45.8 | 13.38,45.8 IC7.1 13.38,45.8 | 42.67,48.97 16.55,48.97 | 16.55,48.97 13.38,45.8
  Bottom 0.254: X8.8 43.4,57.82 v43.4,49.7
!IODI
  Bottom 0.254: X1.75 96.52,5.08 96.52,7.63 97.75,8.87 97.75,22.29 X2.1
!IORQ
  Bottom 0.254: IC1.11 45.72,7.24 45.72,6.09 46.73,5.08 47.24,5.08 48.26,4.07 48.26,3.56 49.08,2.73 63.69,2.73 X1.51
!IRD  (via drill 0.2)
  Top 0.254: v74.9,20.5 74.79,20.5 74.71,20.42 66.42,20.42 IC2.14 | v42,14.3 v63.4,14.3 | IC1.14 39.89,21.01 24.65,21.01 IC5.2
  Bottom 0.254: IC3.1 74.9,12.86 v74.9,20.5 | IC1.14 41.93,14.37 v42,14.3 | v63.4,14.3 63.4,17.4 IC2.14
!IRESET  (via drill 0.2)
  Top 0.254: v56.3,27.7 76.06,27.7 IC4.1
  Bottom 0.254: IC2.18 56.3,20.46 v56.3,27.7
!IWR
  Top 0.254: IC5.3 26.8,21.41 42.03,21.41 IC1.13 45.78,20.28 58.87,20.28 59.73,19.42 IC2.16
!LCT
  Top 0.254: IC6.12 96.89,46.6 98.16,45.33 98.16,34.54 95.96,32.34 8.3,32.34 X4.3
!M1
  Bottom 0.254: IC1.10 40.64,9.78 40.64,6.09 41.66,5.08 45.72,5.08 X1.37
!MOTOR
  Bottom 0.254: IC8.18 53.6,54.3 53.6,57.86 X8.16
!RD
  Bottom 0.254: X1.49 63.5,5.08 63.5,9.35 62.27,10.58 IC2.6
!RDATA
  Top 0.254: IC7.11 21,53.42 25.19,57.61 71.13,57.61 X8.30
  Bottom 0.254: X8.30 73.66,60.14 78.41,60.14 RN1.6
!RDY
  Bottom 0.254: T1.3 85.87,23.1 85.87,14.99 88.19,12.66 94.71,12.66 95.21,12.16 95.21,10.22 92.71,7.72 92.56,7.72 91.63,6.8 91.63,4.89 X1.73
!RESET
  Bottom 0.254: X1.39 50.61,4.89 50.61,9.08 52.11,10.58 IC2.2
!RW/!SEEK
  Top 0.254: IC6.1 76.57,40.2 76.54,40.17 20.99,40.17 IC5.39
  Bottom 0.254: IC5.39 18.46,42.7 IC7.3
!SIDE
  Top 0.254: IC8.15 61.77,54.85 69.79,54.85 71.39,56.45 71.39,56.75 72.51,57.87 73.93,57.87 X8.32
!STEP
  Bottom 0.254: IC6.7 95.7,43.48 95.7,50.9 95.7,51.3 95.7,51.5 86.4,60.8 61.62,60.8 X8.20
!TRK0  (via drill 0.2)
  Top 0.254: v68.8,51 80.06,51 RN1.4
  Bottom 0.254: IC6.17 84.19,49.28 RN1.4 | X8.26 68.8,57.92 v68.8,51
!TS  (via drill 0.2)
  Top 0.254: X3.2 7.58,33.08 89.78,33.08 v90.4,33.7
  Bottom 0.254: IC6.15 87.9,45.84 87.9,38.7 90.6,36 90.6,33.9 v90.4,33.7
!WDATA
  Bottom 0.254: IC8.17 55.21,52.97 58.96,56.72 58.96,57.02 59.81,57.87 61.23,57.87 X8.22
!WGATE
  Bottom 0.254: IC8.16 59.09,54.71 62.03,54.71 63.78,56.46 63.78,57.88 X8.24
!WR
  Bottom 0.254: X1.47 58.42,5.08 58.42,9.35 57.19,10.58 IC2.4
!WRTPRO
  Bottom 0.254: IC6.4 84.19,44.2 82.9,45.49 82.9,48.9 82,49.8 81.13,49.8 RN1.3 76.47,54.46 76.47,56.75 75.58,57.64 71.62,57.64 X8.28
A0
  Bottom 0.254: X1.31 40.88,2.3 65.1,2.3 66.1,3.3 66.1,9.94 IC2.8
A1
  Bottom 0.254: X1.29 35.56,5.08 35.56,7.24 IC1.7
A2
  Bottom 0.254: X1.27 33.02,5.08 33.02,7.24 IC1.6
A3
  Bottom 0.254: X1.25 30.48,5.08 30.48,7.24 IC1.5
A4
  Bottom 0.254: X1.23 27.94,5.08 27.94,7.24 IC1.4
A5
  Bottom 0.254: X1.21 25.4,5.08 25.4,7.24 IC1.3
A6
  Bottom 0.254: X1.19 22.86,5.08 22.86,7.24 IC1.2
A7
  Bottom 0.254: X1.17 20.32,5.08 20.32,7.24 IC1.1
CLK  (via drill 0.2)
  Top 0.254: v53.34,46.14 38.14,46.14 IC8.1
  Bottom 0.254: v53.34,46.14 53.34,5.08 X1.41
D0
  Bottom 0.254: IC3.2 79.11,10.58 78.25,9.72 71.69,9.72 68.58,6.61 68.58,5.08 X1.53
D1
  Bottom 0.254: IC3.3 81.65,10.58 80.17,9.1 73.61,9.1 71.12,6.61 71.12,5.08 X1.55
D2
  Bottom 0.254: IC3.4 84.19,10.58 83.03,10.58 80.93,8.48 78.07,8.48 76.2,6.61 76.2,6.09 75.19,5.08 73.66,5.08 X1.57
D3
  Bottom 0.254: IC3.5 86.73,10.58 85.79,9.64 83.48,9.64 81.68,7.84 79.98,7.84 78.74,6.61 78.74,6.09 77.72,5.08 76.2,5.08 X1.59
D4
  Bottom 0.254: IC3.6 89.27,10.58 87.4,8.71 83.38,8.71 81.28,6.61 81.28,6.09 80.27,5.08 78.74,5.08 X1.61
D5
  Bottom 0.254: IC3.7 91.81,10.58 89.24,8.01 85.23,8.01 83.82,6.61 83.82,6.09 82.81,5.08 81.28,5.08 X1.63
D6
  Bottom 0.254: IC3.8 94.35,10.58 93.34,10.58 90.35,7.58 87.34,7.58 86.17,6.41 86.17,5.9 85.34,5.08 83.82,5.08 X1.65
D7
  Bottom 0.254: IC3.9 96.89,10.58 94.17,7.86 94.17,3.75 93.16,2.73 86.17,2.73 X1.67
DIR_RD
  Top 0.254: IC1.21 25.78,17.34 51.25,17.34 52.11,18.2 IC2.19
DRQ  (via drill 0.2)
  Top 0.254: IC5.14 50.84,25.3 v67.4,25.3
  Bottom 0.254: v67.4,25.3 67.4,18.86 IC2.13
DSENA  (via drill 0.2)
  Top 0.254: v58.7,30 v79.1,30
  Bottom 0.254: IC8.9 58.7,43.68 v58.7,30 | v79.1,30 IC4.2
FDC_CLK  (via drill 0.2)
  Top 0.254: v62.6,34.7 v13.3,34.7
  Bottom 0.254: Y1.5 13.3,22.3 v13.3,34.7 | v62.6,34.7 62.6,41.74 IC5.22
FDC_RDY
  Bottom 0.254: IC7.12 22.27,49 27.9,49 30,46.9 30,42.18 IC5.35
FLT/TR0  (via drill 0.2)
  Top 0.254: IC5.33 35.47,42.57 69.38,42.57 70.61,41.34 75.19,41.34 76.25,42.4 v81.65,42.4
  Bottom 0.254: IC6.3 v81.65,42.4 IC6.18
FR/STEP
  Top 0.254: IC5.37 25.31,40.93 75.43,40.93 76.16,41.66 89.42,41.66 94.35,46.6 IC6.13
  Bottom 0.254: IC6.6 94.35,44.67 IC6.13
GND  (via drill 0.2)
  Top 0.254: IC1.12 49.41,11.03 IC2.1
  Route15 0.254: C1.1 14.7,21.4 14.7,16.08 Y1.4 15.4,7.6 40.66,7.6 X1.34 | C1.1 15.8,25.24 12.42,28.62 | 12.42,28.62 X5.3 11,31.04 v11,34.8 C5.1 9.1,40.9 9.1,42.8 6.54,45.36 X7.3 6.5,51.5 C8.1 | C2.1 v46.7,19 46.7,13.26 IC1.12 41.91,8.47 X1.34 | IC2.10 74.72,8.9 97.14,8.9 IC3.10 98.3,12.32 98.3,20.8 99.43,21.93 IC4.10 100.8,28.56 100.8,38.22 IC6.10 | IC2.10 74.3,13.06 74.3,22 C3.1 | C3.1 74.8,23.5 T1.1 | C3.1 71,25.3 71,26.3 | 71,26.3 C4.1 69.5,32.9 69.5,41.1 70.6,42.2 C6.1 67.8,42.2 IC8.12 | IC5.20 70.95,26.25 71,26.3 | 12.42,28.62 23.2,39.4 25.82,39.4 28.3,41.88 28.3,44.87 IC7.7 32.5,49.07 C7.1 34.5,52 34.5,54 X8.1 X8.3 X8.5 X8.7 X8.9 X8.11 X8.13 X8.15 X8.17 X8.19 X8.21 X8.23 X8.25 X8.27 X8.29 X8.31 X8.33 | X3.1 5.46,22.5 C1.1 | C1.1 17.8,24.5 34.7,24.5 v36.9,22.3 | IC2.10 69.12,7.88 43.44,7.88 X1.34 | X1.33 X1.34
  pour Bottom: 0,60.5 7.6,68.1 100.1,68.1 101.7,66.5 101.7,0.9 100.5,-0.3 0,-0.2
  pour Route15: -0.1,-0.3 -0.1,60.5 7.5,68.1 100.2,68.1 101.7,66.6 101.7,66.5 101.7,0.1 101.3,-0.3 0,-0.3
  pour Top: -0.3,-0.5 -0.3,60.5 7.5,68.3 101.3,68.3 101.5,68.1 101.7,67.9 101.7,67.8 101.7,-0.3 101.9,-0.5
HDL
  Top 0.254: IC8.2 38.31,43.78 29.06,43.78 IC5.36
IA0  (via drill 0.2)
  Top 0.254: v69.9,23.1 69.56,23.44 44.72,23.44 44.23,23.93 29.35,23.93 IC5.5
  Bottom 0.254: IC2.12 v69.89,23.09 v69.9,23.1 | IC1.8 28.16,17.18 28.16,25.12 IC5.5
IDB0  (via drill 0.2)
  Top 0.254: v33.1,16.1 v54.7,16.1 v81.6,16.1
  Bottom 0.254: IC2.3 54.65,16.05 v54.7,16.1 | v33.1,16.1 33.1,22.54 29.57,26.07 IC5.6 | v81.6,16.1 81.65,16.15 IC3.18 IC4.3
IDB1  (via drill 0.2)
  Top 0.254: v84.1,15.5 v59.7,15.5 v35.6,15.5
  Bottom 0.254: IC4.4 82.4,25.4 82.4,20.7 84.19,18.91 IC3.17 84.19,18.7 84.19,15.59 v84.1,15.5 | IC5.7 35.6,22.76 v35.6,15.5 | IC2.5 59.73,15.47 v59.7,15.5
IDB2  (via drill 0.2)
  Top 0.254: v86.7,14.8 v64.8,14.8 38,14.8 v37.9,14.9
  Bottom 0.254: IC4.7 91.81,25.31 86.73,20.23 IC3.16 86.73,14.83 v86.7,14.8 | v37.9,14.9 37.9,23 IC5.8 | IC2.7 v64.81,14.79 v64.8,14.8
IDB3  (via drill 0.2)
  Top 0.254: v89.3,13.6 v69.9,13.6 v40.6,13.6
  Bottom 0.254: IC4.8 94.35,24.45 93.62,23.72 93.62,21.32 93,20.7 93,16.5 90.1,13.6 v89.3,13.6 89.27,13.63 IC3.15 | v40.6,13.6 40.6,22.84 IC5.9 | IC2.9 v69.89,13.59 v69.9,13.6
IDB4
  Top 0.254: IC3.14 91.81,19.42 88.62,22.61 77.81,22.61 76.54,23.87 47.37,23.87 46.74,24.5 41.48,24.5 IC5.10
  Bottom 0.254: IC4.13 93.2,33.66 93.2,25.4 91,23.2 91,19.62 IC3.14
IDB5  (via drill 0.2)
  Top 0.254: IC3.13 v89.08,24.08 88.78,24.38 48.14,24.38 47.41,25.11 43.41,25.11 IC5.11
  Bottom 0.254: v89.08,24.08 90.5,25.5 90.5,30 91.81,31.31 IC4.14
IDB6  (via drill 0.2)
  Top 0.254: v98.2,28.8 v86.7,28.8 v44.8,28.8
  Bottom 0.254: v98.2,28.8 98.2,26.05 96.2,24.05 96.2,19.5 IC3.12 | v44.8,28.8 44.8,26.26 IC5.12 | IC4.17 84.19,31.51 86.7,29 v86.7,28.8
IDB7  (via drill 0.2)
  Top 0.254: IC3.11 99.43,19.42 99.43,22.47 96.9,25 v80.4,25 80.25,24.84 48.76,24.84 IC5.13
  Bottom 0.254: v80.4,25 80.4,33.56 IC4.18
INDEX  (via drill 0.2)
  Top 0.254: v57.4,35.6 57.3,35.7 v15.9,35.7
  Bottom 0.254: IC5.17 57.51,35.49 v57.4,35.6 | v15.9,35.7 15.9,45.17 IC7.2
IOENA  (via drill 0.2)
  Top 0.254: IC1.9 38.82,13 92.5,13 v93.1,13.6
  Bottom 0.254: X2.2 95.21,22.29 95.21,15.71 v93.1,13.6
IRQ
  Bottom 0.254: IC2.15 62.27,24.03 IC5.18
LCT/DIR
  Top 0.254: IC5.38 23.15,40.55 75.7,40.55 76.21,41.06 93.49,41.06 94.35,40.2 IC6.8
  Bottom 0.254: IC6.8 99.4,44.64 99.4,47.18 IC6.11
MFM  (via drill 0.2)
  Top 0.254: v72.4,39.4 v52.4,39.4
  Bottom 0.254: IC2.11 72.43,39.37 v72.4,39.4 | IC5.26 52.43,39.43 v52.4,39.4
MINI  (via drill 0.2)
  Top 0.254: IC4.6 88.18,26.1 67.56,26.1 66.56,27.1 v58.7,27.1
  Bottom 0.254: IC2.17 58.7,20.32 v58.7,27.1 65.13,33.53 IC5.21
MOTOR  (via drill 0.2)
  Top 0.254: v82.9,43.8 45.88,43.8 IC8.4
  Bottom 0.254: IC4.5 82.9,31.02 v82.9,43.8
N$1
  Bottom 0.254: IC7.9 IC7.10
N$3
  Top 0.254: R1.2 43.42,21.16 84.56,21.16 T1.2
P0  (via drill 0.2)
  Top 0.254: IC4.15 86.98,37.1 v57.5,37.1
  Bottom 0.254: v57.5,37.1 57.5,41.74 IC5.24
P1  (via drill 0.2)
  Top 0.254: IC4.12 93.65,38.05 40.25,38.05 v39.8,38.5
  Bottom 0.254: v39.8,38.5 39.8,41.68 IC5.31
P2  (via drill 0.2)
  Top 0.254: v37.1,28.3 37.15,28.34 95.73,28.34 IC4.9
  Bottom 0.254: IC5.32 37.1,41.66 v37.1,28.3
RDY
  Bottom 0.254: IC1.18 31.77,22.35 R1.1
RST
  Bottom 0.254: IC5.1 25.7,35.08 25.7,44.81 IC7.6
RW/!SEEK
  Top 0.254: IC7.4 21,45.8 22.01,46.8 70.18,46.8 72.18,48.81 78.12,48.81 79.11,47.82 IC6.19
SIDE
  Bottom 0.254: IC5.27 49.89,42.65 IC8.7
TC  (via drill 0.2)
  Top 0.254: v30.7,27.7 53.52,27.7 IC5.16
  Bottom 0.254: IC1.17 34.31,22.78 30.7,26.39 v30.7,27.7
US0
  Bottom 0.254: IC5.29 44.81,42.65 IC8.5
US1
  Bottom 0.254: IC5.28 47.35,42.65 IC8.6
WDATA
  Bottom 0.254: IC5.30 42.27,44.87 IC8.3
WGATE
  Bottom 0.254: IC5.25 54.97,44.87 IC8.8
WP/TS  (via drill 0.2)
  Top 0.254: IC5.34 33.46,43.1 v86.7,43.1
  Bottom 0.254: IC6.5 86.73,43.07 v86.7,43.1 86.7,47.18 IC6.16

### Text on the board
tNames: RCBus compatible Design / FDC9266 Floppy Controller
bNames: RCBus compatible Design / FDC9266 Floppy Controller